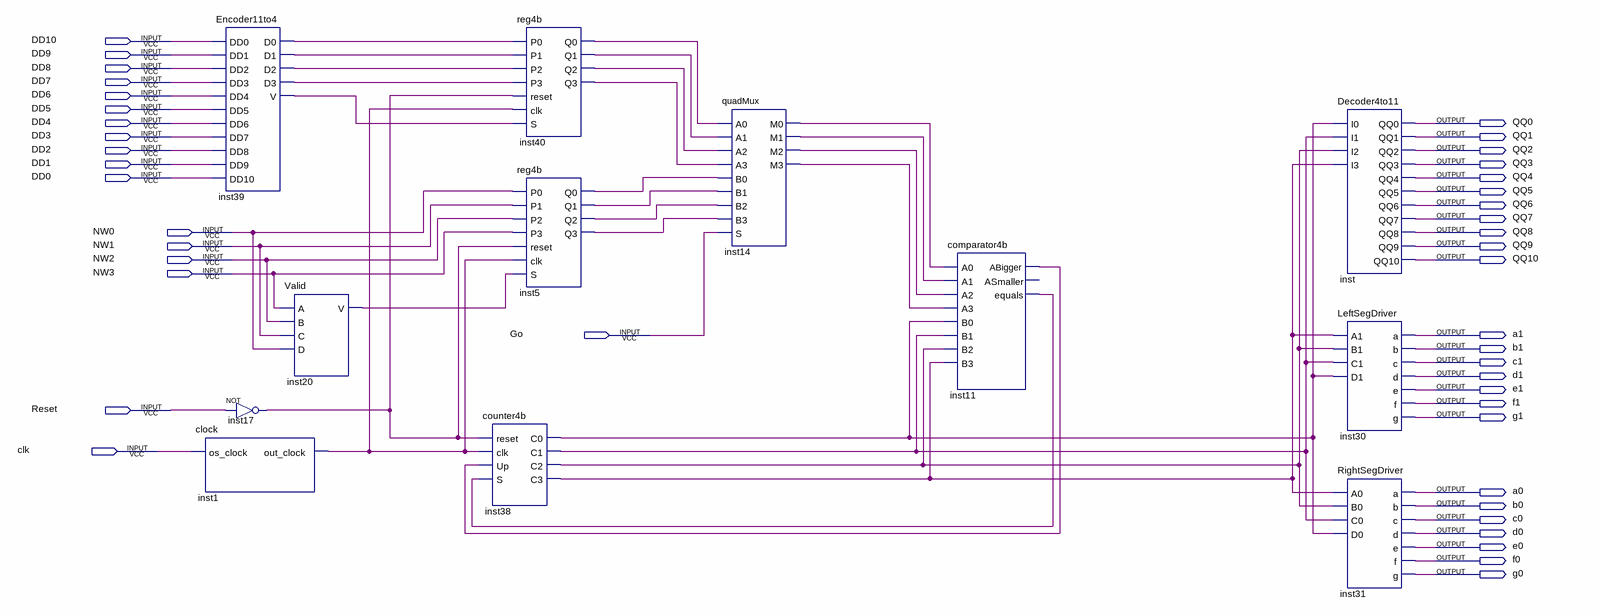
[diagram p0: schematic sheet]
// Quartus schematic circuit1.bdf as structural Verilog: 12 symbols, 43 pins
module circuit1 (
  input  DD10,
  input  DD9,
  input  DD8,
  input  DD7,
  input  DD6,
  input  DD5,
  input  DD4,
  input  DD3,
  input  DD2,
  input  DD1,
  input  DD0,
  input  NW0,
  input  NW1,
  input  NW2,
  input  NW3,
  input  Go,
  input  Reset,
  input  clk,
  output QQ0,
  output QQ1,
  output QQ2,
  output QQ3,
  output QQ4,
  output QQ5,
  output QQ6,
  output QQ7,
  output QQ8,
  output QQ9,
  output QQ10,
  output a1,
  output b1,
  output c1,
  output d1,
  output e1,
  output f1,
  output g1,
  output a0,
  output b0,
  output c0,
  output d0,
  output e0,
  output f0,
  output g0
);

  wire inst1_out_clock, inst5_q0, inst5_q1, inst5_q2, inst5_q3, inst11_abigger, inst11_equals, inst14_m0,
       inst14_m1, inst14_m2, inst14_m3, inst17_out, inst20_v, inst38_c0, inst38_c1, inst38_c2, inst38_c3,
       inst39_d0, inst39_d1, inst39_d2, inst39_d3, inst39_v, inst40_q0, inst40_q1, inst40_q2, inst40_q3;

  Encoder11to4 inst39 (
    .DD0(DD10), .DD1(DD9), .DD2(DD8), .DD3(DD7), .DD4(DD6), .DD5(DD5), .DD6(DD4), .DD7(DD3), .DD8(DD2),
    .DD9(DD1), .DD10(DD0), .D0(inst39_d0), .D1(inst39_d1), .D2(inst39_d2), .D3(inst39_d3), .V(inst39_v));
  not inst17 (inst17_out, Reset);
  clock inst1 (.os_clock(clk), .out_clock(inst1_out_clock));
  Valid inst20 (.A(NW3), .B(NW2), .C(NW1), .D(NW0), .V(inst20_v));
  counter4b inst38 (
    .reset(inst17_out), .clk(inst1_out_clock), .Up(inst11_abigger), .S(inst11_equals), .C0(inst38_c0),
    .C1(inst38_c1), .C2(inst38_c2), .C3(inst38_c3));
  reg4b inst40 (
    .P0(inst39_d0), .P1(inst39_d1), .P2(inst39_d2), .P3(inst39_d3), .reset(inst17_out),
    .clk(inst1_out_clock), .S(inst39_v), .Q0(inst40_q0), .Q1(inst40_q1), .Q2(inst40_q2), .Q3(inst40_q3));
  reg4b inst5 (
    .P0(NW0), .P1(NW1), .P2(NW2), .P3(NW3), .reset(inst17_out), .clk(inst1_out_clock), .S(inst20_v),
    .Q0(inst5_q0), .Q1(inst5_q1), .Q2(inst5_q2), .Q3(inst5_q3));
  quadMux inst14 (
    .A0(inst40_q0), .A1(inst40_q1), .A2(inst40_q2), .A3(inst40_q3), .B0(inst5_q0), .B1(inst5_q1),
    .B2(inst5_q2), .B3(inst5_q3), .S(Go), .M0(inst14_m0), .M1(inst14_m1), .M2(inst14_m2), .M3(inst14_m3));
  comparator4b inst11 (
    .A0(inst14_m0), .A1(inst14_m1), .A2(inst14_m2), .A3(inst14_m3), .B0(inst38_c0), .B1(inst38_c1),
    .B2(inst38_c2), .B3(inst38_c3), .ABigger(inst11_abigger), .equals(inst11_equals));  // open: ASmaller
  Decoder4to11 inst (
    .I0(inst38_c0), .I1(inst38_c1), .I2(inst38_c2), .I3(inst38_c3), .QQ0(QQ0), .QQ1(QQ1), .QQ2(QQ2),
    .QQ3(QQ3), .QQ4(QQ4), .QQ5(QQ5), .QQ6(QQ6), .QQ7(QQ7), .QQ8(QQ8), .QQ9(QQ9), .QQ10(QQ10));
  LeftSegDriver inst30 (
    .A1(inst38_c3), .B1(inst38_c2), .C1(inst38_c1), .D1(inst38_c0), .a(a1), .b(b1), .c(c1), .d(d1), .e(e1),
    .f(f1), .g(g1));
  RightSegDriver inst31 (
    .A0(inst38_c3), .B0(inst38_c2), .C0(inst38_c1), .D0(inst38_c0), .a(a0), .b(b0), .c(c0), .d(d0), .e(e0),
    .f(f0), .g(g0));
endmodule
